# Altium schematic sheet Sheet1.SchDoc
size A4
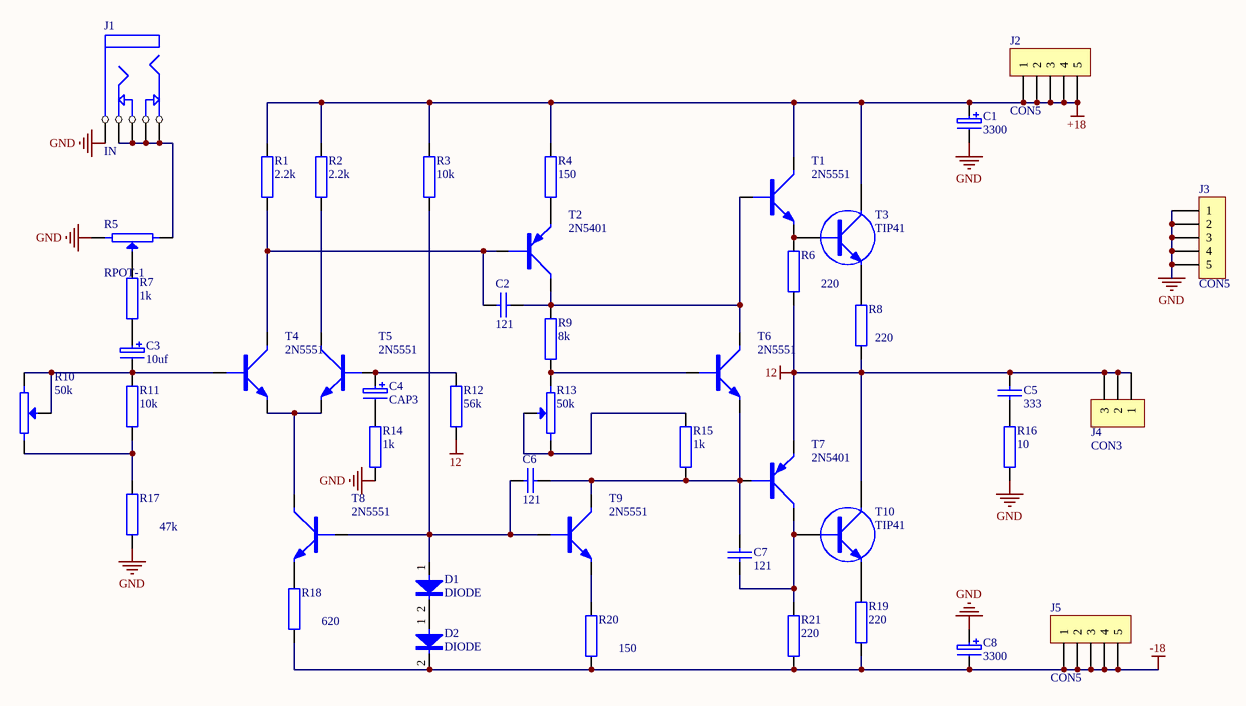
[diagram p0: Sheet1.SchDoc]

## Parts
C1  3300  [C18]
C2  121  [CAP2]
C3  10uf  [CAO2]
C4  CAP3  [CAO2]
C5  333  [CAP2]
C6  121  [CAP2]
C7  121  [CAP2]
C8  3300  [C18]
D1  DIODE  [DIODE0.2]
D2  DIODE  [DIODE0.2]
J1  IN  [SOUND1]
J2  CON5  [sip-5]
J3  CON5  [sip-5]
J4  CON3  [sip-3]
J5  CON5  [sip-5]
R1  2.2k  [AXIAL0.3]
R2  2.2k  [AXIAL0.3]
R3  10k  [AXIAL0.3]
R4  150  [AXIAL0.3]
R5  RPOT-1  [RVR-A]
R6  220  [AXIAL0.3]
R7  1k  [AXIAL0.3]
R8  220  [AXIAL1.0]
R9  8k  [AXIAL0.3]
R10  50k  [RVR-4]
R11  10k  [AXIAL0.3]
R12  56k  [AXIAL0.3]
R13  50k  [RVR-4]
R14  1k  [AXIAL0.3]
R15  1k  [AXIAL0.3]
R16  10  [AXIAL0.3]
R17  47k  [AXIAL0.3]
R18  620  [AXIAL0.3]
R19  220  [AXIAL1.0]
R20  150  [AXIAL0.3]
R21  220  [AXIAL0.3]
T1  2N5551  [TO-92]
T2  2N5401  [TO-92]
T3  TIP41  [TO-220]
T4  2N5551  [TO-92]
T5  2N5551  [TO-92]
T6  2N5551  [TO-92]
T7  2N5401  [TO-92]
T8  2N5551  [TO-92]
T9  2N5551  [TO-92]
T10  TIP41  [TO-220]

## Nets
12: C5.1 J4.1 J4.2 J4.3 R6.1 R8.1 R12.2 T7.1(e) T10.2(C)
+18: C1.1 J2.1 J2.2 J2.3 J2.4 J2.5 R1.2 R2.2 R3.2 R4.2 T1.3(C) T3.2(C)
-18: C8.2 D2.2 J5.1 J5.2 J5.3 J5.4 J5.5 R18.1 R19.1 R20.1 R21.2
GND: C1.2 C8.1 J1.5(E) J3.1 J3.2 J3.3 J3.4 J3.5 R5.3 R14.1 R16.1 R17.1
NetC2_1: C2.1 R9.2 T1.2(B) T2.3(c) T6.3(C)
NetC2_2: C2.2 R1.1 T2.2(B) T4.3(C)
NetC3_1: C3.1 R7.1
NetC3_2: C3.2 R10.1 R10.2(W) R11.2 T4.2(B)
NetC4_1: C4.1 R12.1 T5.2(B)
NetC4_2: C4.2 R14.2
NetC5_2: C5.2 R16.2
NetC6_1: C6.1 C7.1 R15.1 T6.1(E) T7.2(B) T9.3(C)
NetC6_2: C6.2 D1.1 R3.1 T8.2(B) T9.2(B)
NetC7_2: C7.2 R21.1 T7.3(c) T10.1(B)
NetD1_2: D1.2 D2.1
NetJ1_1: J1.1(A) J1.2(B) J1.3(C) J1.4(D) R5.1
NetR2_1: R2.1 T5.3(C)
NetR4_1: R4.1 T2.1(e)
NetR5_2: R5.2(W) R7.2
NetR6_2: R6.2 T1.1(E) T3.1(B)
NetR8_2: R8.2 T3.3(E)
NetR9_1: R9.1 R13.3 T6.2(B)
NetR10_3: R10.3 R11.1 R17.2
NetR13_1: R13.1 R13.2(W) R15.2
NetR18_2: R18.2 T8.1(E)
NetR19_2: R19.2 T10.3(E)
NetR20_2: R20.2 T9.1(E)
NetT4_1: T4.1(E) T5.1(E) T8.3(C)

## Library data of the parts
C1 C3 C8 = CAP3
C2 C5-C7 = CAP1
J1 = PHONEJACK ST
J2 J3 J5 = CON5: Connector
J4 = CON3: Connector
R1-R4 R6-R9 R11 R12 R14-R21 = RES
R5 R10 R13 = RPOT-1: Potentiometer
T1 T4-T6 T8 T9 = 2N5551: NPN,小功率
T2 T7 = 2N5401: PNP,小功率
T3 T10 = TIP41: NPN PLASTIC POWER TRANSISTORS